# Altium project PCB_Project1.PrjPCB
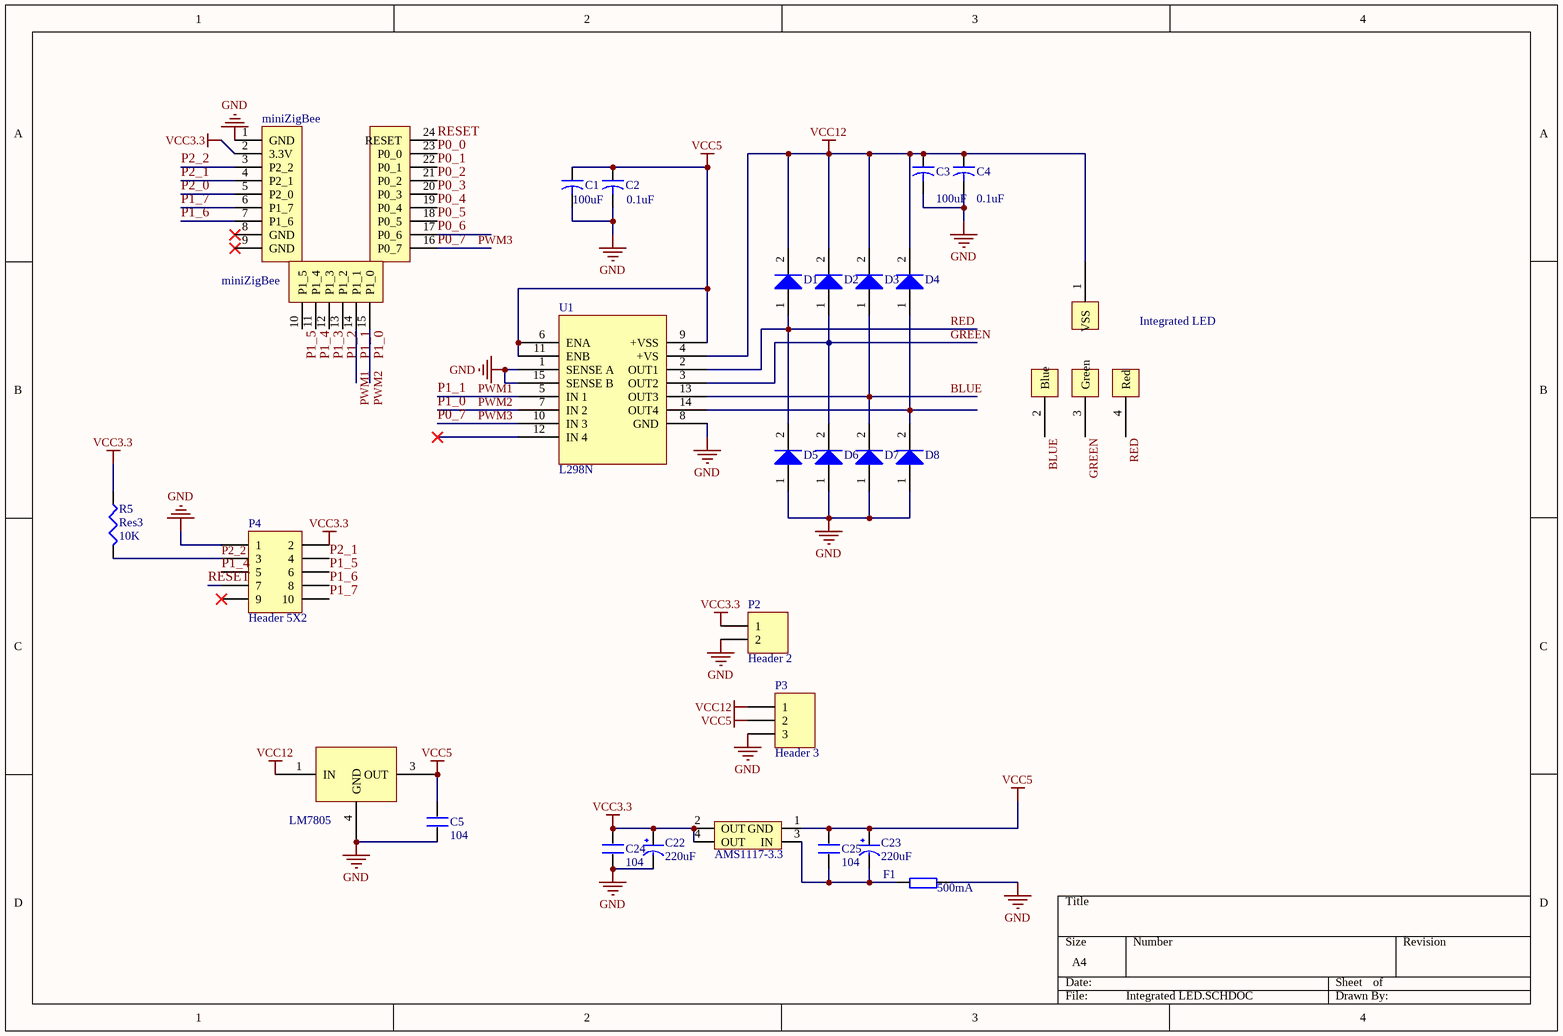
[diagram p0: Integrated LED.SCHDOC]
1 sheet, 27 parts. Net scope: global (net labels, ports and power ports of the same name join across sheets).
Board file: Integrated LED.PcbDoc

## Sheet Integrated LED.SCHDOC
size A4

### Parts
C1  value 100uF  [PCBComponent_1]
C2  value 0.1uF  [PCBComponent_1]
C3  value 100uF  [PCBComponent_1]
C4  value 0.1uF  [PCBComponent_1]
C5  104  [0603P]
C22  220uF  [CC6.56.5]
C23  220uF  [CC6.56.5]
C24  104  [0603P]
C25  104  [0603P]
D1  IN4007  [IN4007]  (value not drawn)
D2  IN4007  [IN4007]  (value not drawn)
D3  IN4007  [IN4007]  (value not drawn)
D4  IN4007  [IN4007]  (value not drawn)
D5  IN4007  [IN4007]  (value not drawn)
D6  IN4007  [IN4007]  (value not drawn)
D7  IN4007  [IN4007]  (value not drawn)
D8  IN4007  [IN4007]  (value not drawn)
F1  500mA  [0603P]
Integrated_LED  Integrated LED  [Integrated LED]  (value not drawn)
LM7805  LM7805  [LM7805]  (value not drawn)
miniZigBee  miniZigBee  [miniZigBee]
P2  Header 2  [HDR1X2]
P3  Header 3  [HDR1X3]
P4  Header 5X2  [HDR2X5]
R5  Res3  value 10K  [J1-0603]
U1  L298N  [L298N - duplicate]
U6  AMS1117-3.3  [AMS1117]

### Nets
GND: C1.2 C2.2 C3.2 C4.2 C5.1 C22.2(GND) C24.1 D5.1(A) D6.1(A) D7.1(A) D8.1(A) F1.2 LM7805.4(GND) miniZigBee.1(GND) P2.2 P3.3 P4.1 U1.1(SENSE_A) U1.8(GND) U1.15(SENSE_B)
VCC3.3: C22.1(VCC) C24.2 miniZigBee.2(3.3V) P2.1 P4.2 R5.1 U6.2(OUT) U6.4(OUT)
VCC5: C1.1 C2.1 C5.2 C23.1(VCC) C25.2 LM7805.3(OUT) P3.2 U1.6(ENA) U1.9(+VSS) U1.11(ENB) U6.1(GND)
VCC12: C3.1 C4.1 D1.2(K) D2.2(K) D3.2(K) D4.2(K) Integrated_LED.1(VSS) LM7805.1(IN) P3.1 U1.4(+VS)
BLUE: D3.1(A) D7.2(K) Integrated_LED.2(Blue) U1.13(OUT3)
GREEN: D2.1(A) D6.2(K) Integrated_LED.3(Green) U1.3(OUT2)
P0_0: miniZigBee.23(P0_0)
P0_1: miniZigBee.22(P0_1)
P0_2: miniZigBee.21(P0_2)
P0_3: miniZigBee.20(P0_3)
P0_4: miniZigBee.19(P0_4)
P0_5: miniZigBee.18(P0_5)
P0_6: miniZigBee.17(P0_6)
P0_7: miniZigBee.16(P0_7) U1.10(IN_3)  [also labelled PWM3]
P1_0: miniZigBee.15(P1_0) U1.7(IN_2)  [also labelled PWM2]
P1_1: miniZigBee.14(P1_1) U1.5(IN_1)  [also labelled PWM1]
P1_2: miniZigBee.13(P1_2)
P1_3: miniZigBee.12(P1_3)
P1_4: miniZigBee.11(P1_4) P4.5
P1_5: miniZigBee.10(P1_5) P4.6
P1_6: miniZigBee.7(P1_6) P4.8
P1_7: miniZigBee.6(P1_7) P4.10
P2_0: miniZigBee.5(P2_0)
P2_1: miniZigBee.4(P2_1) P4.4
P2_2: miniZigBee.3(P2_2) P4.3 R5.2
RED: D1.1(A) D5.2(K) Integrated_LED.4(Red) U1.2(OUT1)
RESET: miniZigBee.24(RESET) P4.7
NetC23_2: C23.2(GND) C25.1 F1.1 U6.3(IN)
NetD4_1: D4.1(A) D8.2(K) U1.14(OUT4)

Not connected (* = marked no-connect by the designer): miniZigBee 8(GND)* 9(GND)*; P4 9*; U1 12(IN_4)*

### Library data of the parts
C1-C4 = Cap2: Capacitor; Published: 23-Sep-2002; PackageReference: CAPR5-4X5; Publisher: Altium Limited
C5 C24 C25 = C
C22 C23 = CAP
F1 = R
P2 = Header 2: Header, 2-Pin; LatestRevisionDate: 17-Jul-2002; LatestRevisionNote: Re-released for DXP Platform.; Publisher: Altium Limited
P3 = Header 3: Header, 3-Pin; LatestRevisionDate: 17-Jul-2002; LatestRevisionNote: Re-released for DXP Platform.; Publisher: Altium Limited
P4 = Header 5X2: Header, 5-Pin, Dual row; LatestRevisionDate: 17-Jul-2002; LatestRevisionNote: Re-released for DXP Platform.; Publisher: Altium Limited
R5 = Res3: Resistor; Published: 8-Jun-2000; LatestRevisionDate: 29-May-2009; LatestRevisionNote: IPC-7351 Footprint Added.; PackageReference: J1-0603; Publisher: Altium Limited; PackageDescription: Chip Resistor
U6 = AMS1117